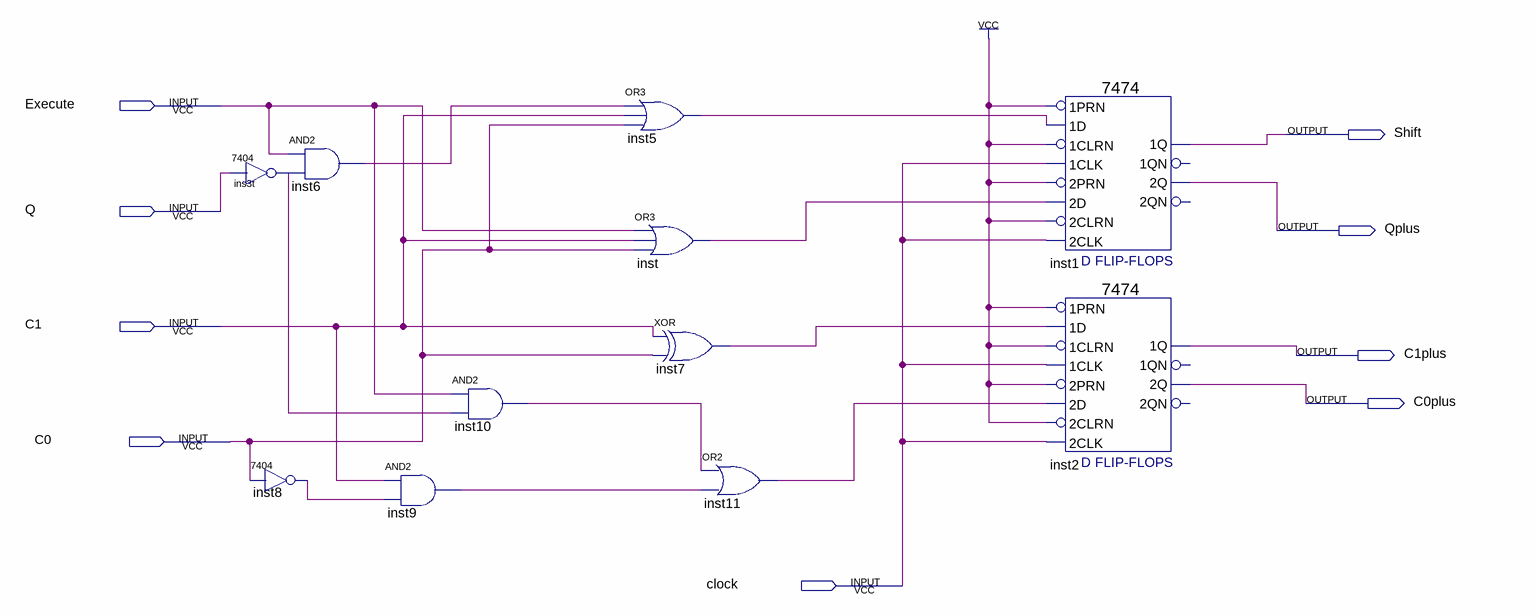
[diagram p0: schematic sheet]
// Quartus schematic controlunit.bdf as structural Verilog: 11 symbols, 9 pins
module controlunit (
  input  Execute,
  input  Q,
  input  C1,
  input  C0,
  input  clock,
  output Shift,
  output Qplus,
  output C1plus,
  output C0plus
);

  wire ins3t_1, inst5_out, inst6_out, inst7_out, inst8_1, inst9_out, inst10_out, inst11_out, inst_out;

  \7404  ins3t (.\2 (Q), .\1 (ins3t_1));
  \7404  inst8 (.\2 (C0), .\1 (inst8_1));
  and inst6 (inst6_out, Execute, ins3t_1);
  and inst9 (inst9_out, C1, inst8_1);
  and inst10 (inst10_out, Execute, ins3t_1);
  or inst5 (inst5_out, inst6_out, C1, C0);
  or inst (inst_out, Execute, C1, C0);
  xor inst7 (inst7_out, C1, C0);
  or inst11 (inst11_out, inst10_out, inst9_out);
  \7474  inst1 (
    .\2D (inst_out), .\2PRN (1'b1), .\1CLK (clock), .\1D (inst5_out), .\1PRN (1'b1), .\2CLK (clock),
    .\2CLRN (1'b1), .\1CLRN (1'b1), .\2Q (Qplus), .\1Q (Shift));  // open: 1QN, 2QN
  \7474  inst2 (
    .\2D (inst11_out), .\2PRN (1'b1), .\1CLK (clock), .\1D (inst7_out), .\1PRN (1'b1), .\2CLK (clock),
    .\2CLRN (1'b1), .\1CLRN (1'b1), .\2Q (C0plus), .\1Q (C1plus));  // open: 1QN, 2QN
endmodule
